# Altium schematic sheet Control_Sense_BOTTMOS V2.SchDoc (part 1 of 3)
size A2 portrait; SheetNumber: 4; SheetTotal: 5
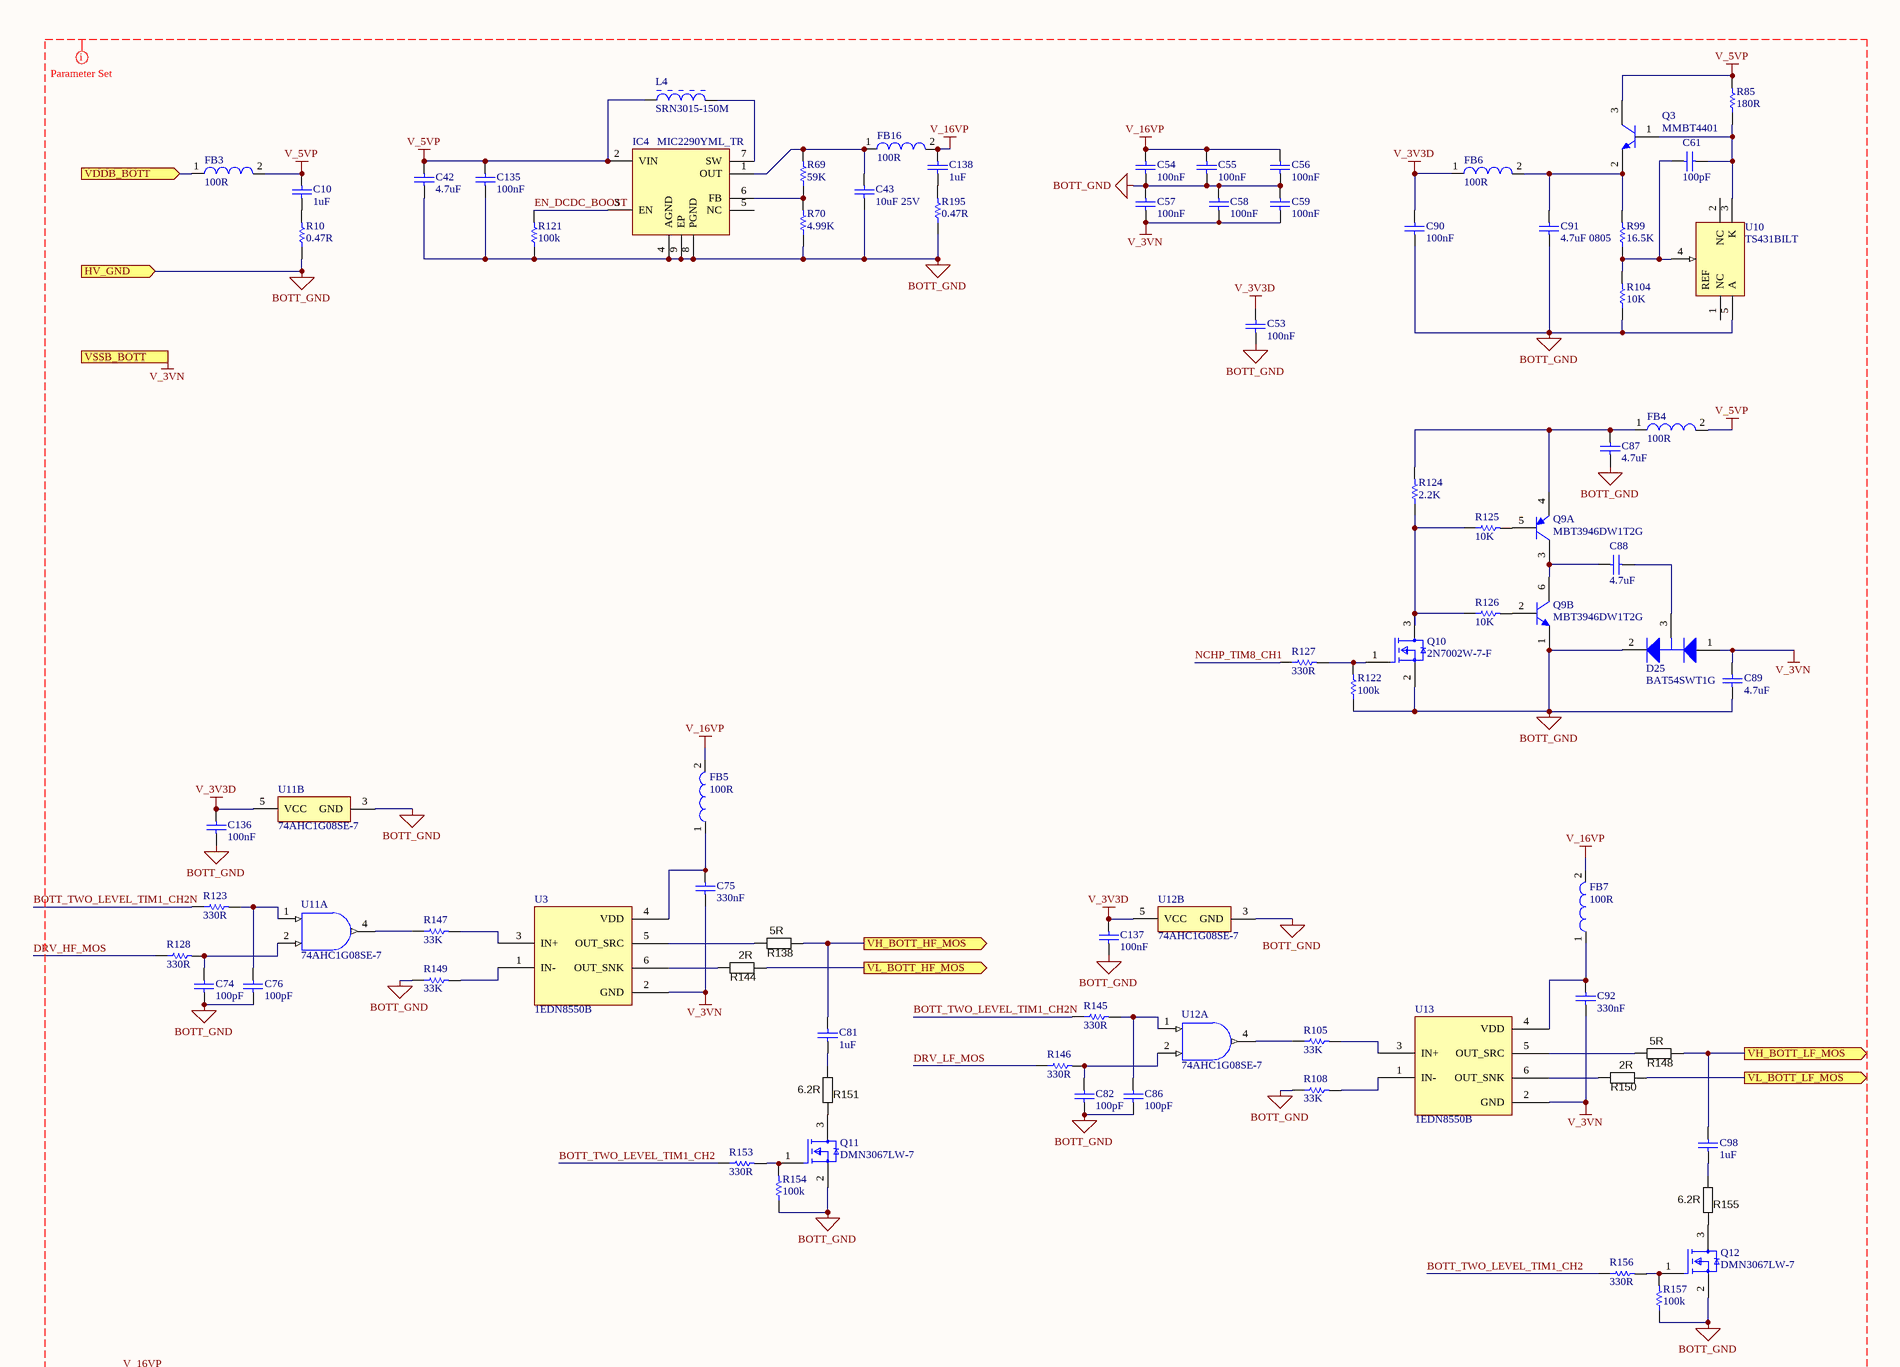
[diagram p0: Control_Sense_BOTTMOS V2.SchDoc, top]
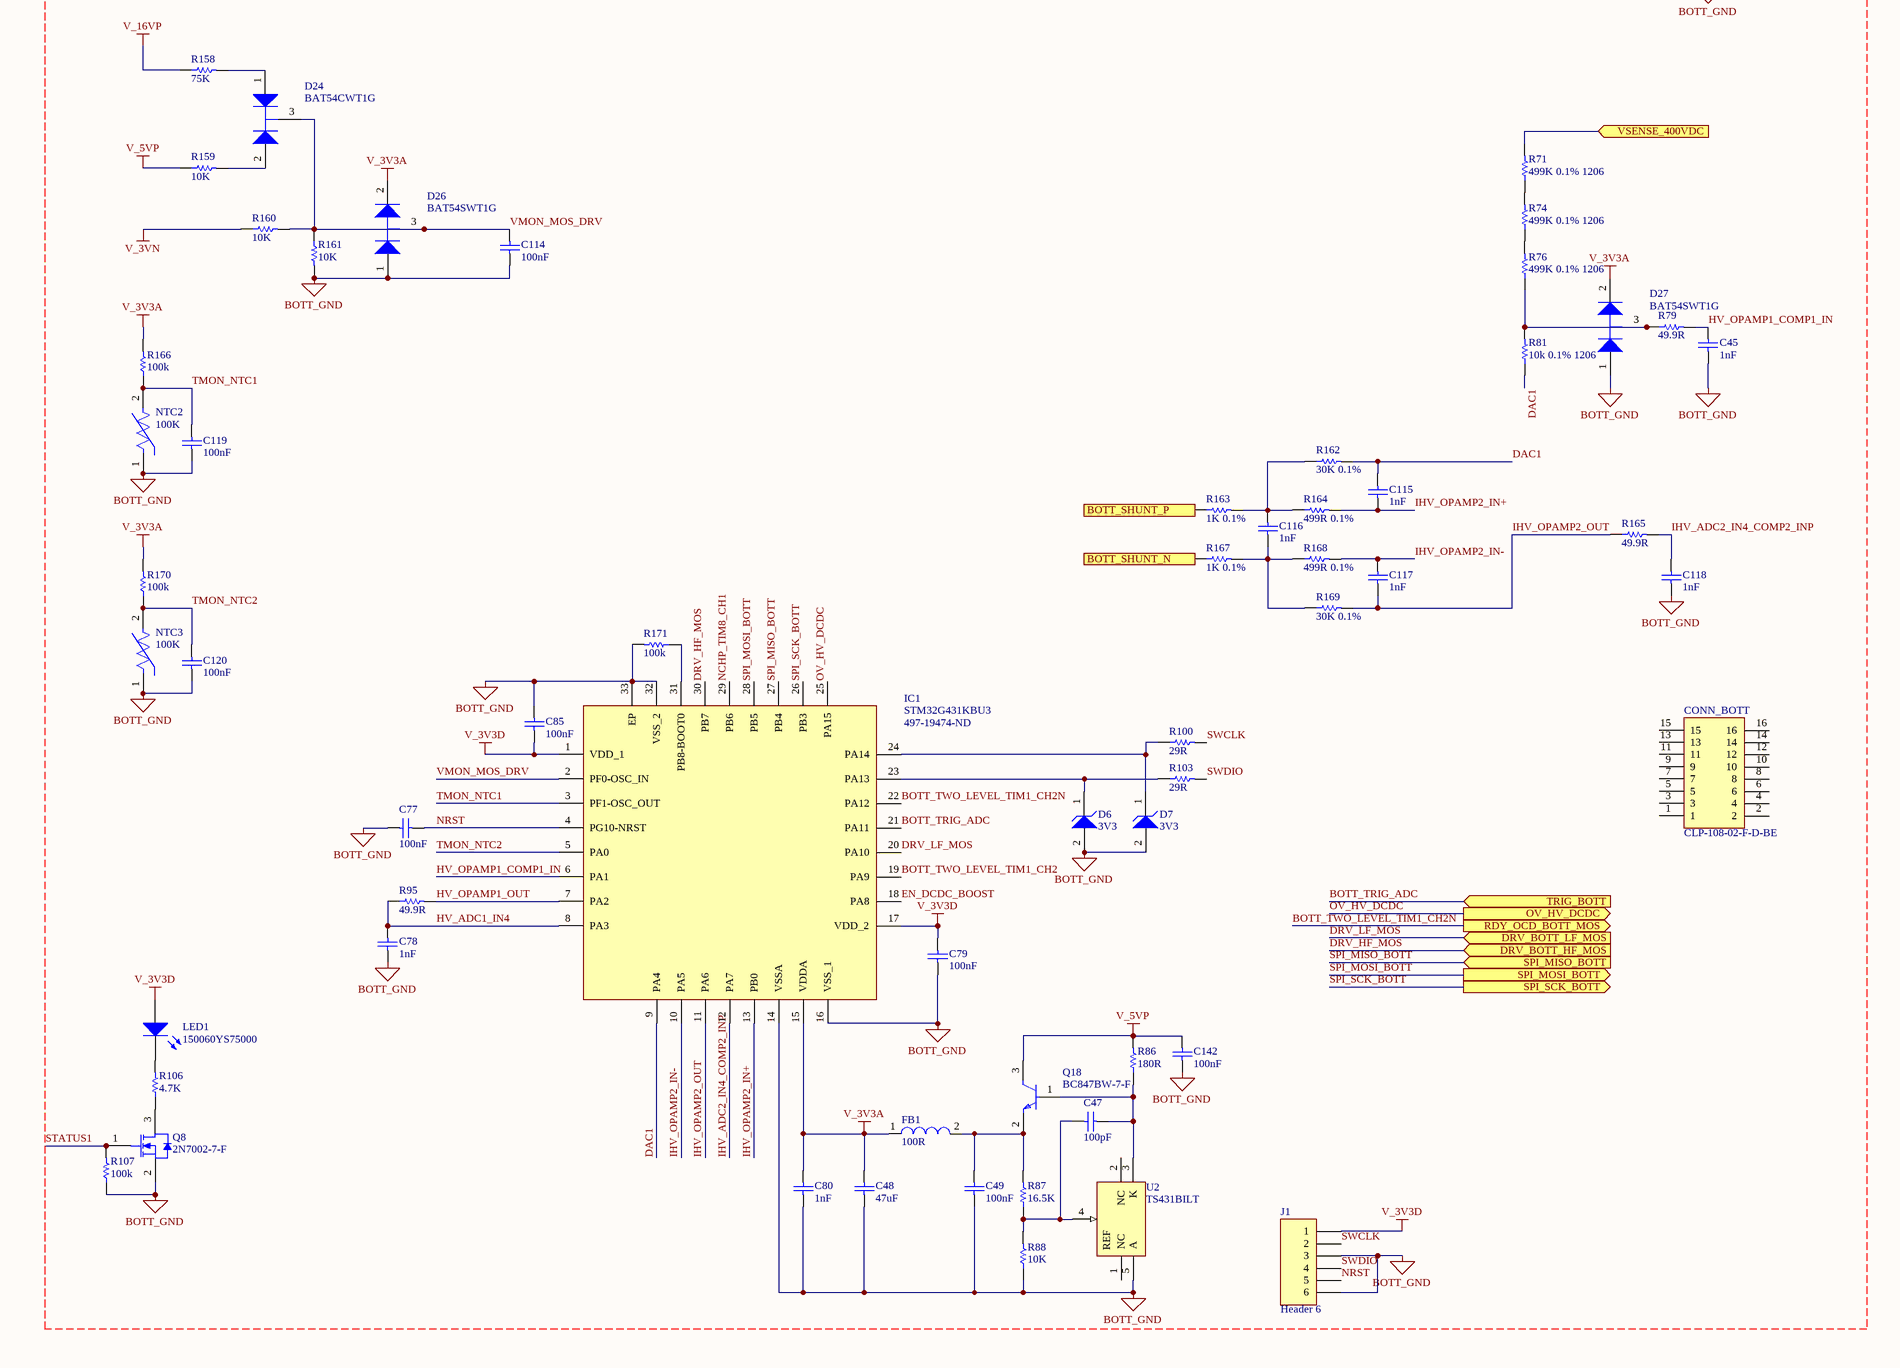
[diagram p1: Control_Sense_BOTTMOS V2.SchDoc, bottom]

## Parts
C10  1uF  [CAPC2013X140X50LL20T25]
C42  4.7uF  [CAPC2013X145X20NL20]
C43  10uF 25V  [CAPC3216X229X50LL20T25]
C45  1nF  [CAPC1005X56X25LL10T15]
C47  100pF  [CAPC1608X90X35NL10T15]
C48  47uF  [CAPC2013X145X50LL20T25]
C49  100nF  [SAMS-C0603-2_N]
C53  100nF  [CAPC1608X90X35LL15T15]
C54  100nF  [CAPC1608X90X35NL15T15]
C55  100nF  [CAPC1608X90X35NL15T15]
C56  100nF  [CAPC1608X90X35NL15T15]
C57  100nF  [CAPC1608X90X35NL15T15]
C58  100nF  [CAPC1608X90X35NL15T15]
C59  100nF  [CAPC1608X90X35NL15T15]
C61  100pF  [CAPC1608X90X35NL10T15]
C74  100pF  [CAPC1608X90X35NL10T15]
C75  330nF  [CAPC2013X135X45NL10T25]
C76  100pF  [CAPC1608X90X35NL10T15]
C77  100nF  [CAPC1608X90X35LL15T15]
C78  1nF  [CAPC1005X56X25LL10T15]
C79  100nF  [SAMS-C0603-2_N]
C80  1nF  [CAPC1005X56X25LL10T15]
C81  1uF  [CAPC2013X135X45NL10T25]
C82  100pF  [CAPC1608X90X35NL10T15]
C85  100nF  [CAPC1608X90X35LL15T15]
C86  100pF  [CAPC1608X90X35NL10T15]
C87  4.7uF  [SAMS-C0603-2_L]
C88  4.7uF  [SAMS-C0603-2_L]
C89  4.7uF  [SAMS-C0603-2_L]
C90  100nF  [SAMS-C0603-2_N]
C91  4.7uF 0805  [CAPC2013X145X20NL20]
C92  330nF  [CAPC2013X135X45NL10T25]
C98  1uF  [CAPC2013X135X45NL10T25]
C114  100nF  [CAPC1608X90X35LL15T15]
C115  1nF  [CAPC1005X56X25LL10T15]
C116  1nF  [CAPC1608X90X35LL15T15]
C117  1nF  [CAPC1005X56X25LL10T15]
C118  1nF  [CAPC1005X56X25LL10T15]
C119  100nF  [CAPC1608X90X35LL15T15]
C120  100nF  [CAPC1608X90X35LL15T15]
C135  100nF  [CAPC1608X90X35LL15T15]
C136  100nF  [CAPC1608X90X35LL15T15]
C137  100nF  [CAPC1608X90X35LL15T15]
C138  1uF  [CAPC2013X140X50LL20T25]
C142  100nF  [SAMS-C0603-2_N]
CONN_BOTT  CLP-108-02-F-D-BE  [CLP-108-02-XXX-D-BE]
D6  3V3  [ONSC-SOD-523-2-502-01_V]
D7  3V3  [ONSC-SOD-523-2-502-01_V]
D24  BAT54CWT1G  [ONSC-SOT-323-3-419-04_V]
D25  BAT54SWT1G  [ONSC-SOT-323-3-419-04_V]
D26  BAT54SWT1G  [ONSC-SOT-323-3-419-04_V]
D27  BAT54SWT1G  [ONSC-SOT-323-3-419-04_V]
FB1  100R  [SMD-0603]
FB3  100R  [SMD-0603]
FB4  100R  [SMD-0603]
FB5  100R  [SMD-0603]
FB6  100R  [SMD-0603]
FB7  100R  [SMD-0603]
FB16  100R  [SMD-0603]
IC1  STM32G431KBU3  Supplier Part Number 1: 497-19474-ND  [QFN50P500X500X60-33N-D]
IC4  MIC2290YML_TR  [SON50P200X200X95-9N-D]
J1  Header 6  [HDR1X6]
L4  SRN3015-150M  [BOUR-SRN3015-2_V]
LED1  150060YS75000  [0603_A]
NTC2  100K  [FP-NXR_151B030-MFG]
NTC3  100K  [FP-NXR_151B030-MFG]
Q3  MMBT4401  [FAIR-SOT23-3_V]
Q8  2N7002-7-F  [DIOD-SOT23-3_V]
Q9  MBT3946DW1T2G  [ONSC-SC70-6-419B-02_W_V]  (parts A,B of 2)
Q10  2N7002W-7-F  [FP-SOT323-IPC_C]
Q11  DMN3067LW-7  [FP-SOT323-IPC_C]
Q12  DMN3067LW-7  [FP-SOT323-IPC_C]
Q18  BC847BW-7-F  [FP-SOT323-IPC_C]
R10  0.47R  [RESC1608X55X25ML10T15]
R69  59K  [RESC1608X55X30NL15T15]
R70  4.99K  [RESC1609X50X30NL10T20]
R71  499K 0.1% 1206  [RESC3216X50X50NL20T25]
R74  499K 0.1% 1206  [RESC3216X50X50NL20T25]
R76  499K 0.1% 1206  [RESC3216X50X50NL20T25]
R79  49.9R  [RESC1005X40X25NL05T05]
R81  10k 0.1% 1206  [RESC3216X50X50NL20T20]
R85  180R  [RESC1608X55X25LL10T15]
R86  180R  [RESC1608X55X25LL10T15]
R87  16.5K  [RESC1608X55X30NL15T15]
R88  10K  [RESC1609X55X30NL15T15]
R95  49.9R  [RESC1005X40X25NL05T05]
R99  16.5K  [RESC1608X55X30NL15T15]
R100  29R  [RESC1608X55X30NL20T10]
R103  29R  [RESC1608X55X30NL20T10]
R104  10K  [RESC1609X55X30LL15T15]
R105  33K  [RESC1005X40X25ML05T05]
R106  4.7K  [RESC1608X55X25ML10T15]
R107  100k  [RESC1608X55X25ML10T15]
R108  33K  [RESC1005X40X25ML05T05]
R121  100k  [RESC1608X55X30NL15T15]
R122  100k  [RESC1608X55X30NL15T15]
R123  330R  [RESC1608X55X25NL10T15]
R124  2.2K  [RESC1608X55X25NL10T15]
R125  10K  [RESC1608X55X30NL20T10]
R126  10K  [RESC1608X55X30NL20T10]
R127  330R  [RESC1608X55X25NL10T15]
R128  330R  [RESC1608X55X25NL10T15]
R138  5R  [RESC2012X70N]
R144  2R  [RESC2012X70N]
R145  330R  [RESC1608X55X25NL10T15]
R146  330R  [RESC1608X55X25NL10T15]
R147  33K  [RESC1005X40X25ML05T05]
R148  5R  [RESC2012X70N]
R149  33K  [RESC1005X40X25ML05T05]
R150  2R  [RESC2012X70N]
R151  6.2R  [RESC2012X70N]
R153  330R  [RESC1608X55X25NL10T15]
R154  100k  [RESC1608X55X30NL15T15]
R155  6.2R  [RESC2012X70N]
R156  330R  [RESC1608X55X25NL10T15]
R157  100k  [RESC1608X55X30NL15T15]
R158  75K  [RESC1608X55X30NL15T15]
R159  10K  [RESC1608X55X30NL20T10]
R160  10K  [RESC1608X55X30NL20T10]
R161  10K  [RESC1608X55X30NL20T10]
R162  30K 0.1%  [RESC1608X55N]
R163  1K 0.1%  [RESC1608X55X25NL10T15]
R164  499R 0.1%  [RESC1608X55N]
R165  49.9R  [RESC1005X40X25NL05T05]
R166  100k  [RESC1608X55X30NL15T15]
R167  1K 0.1%  [RESC1608X55X25NL10T15]
R168  499R 0.1%  [RESC1608X55N]
R169  30K 0.1%  [RESC1608X55N]
R170  100k  [RESC1608X55X30NL15T15]
R171  100k  [RESC1608X55X30NL15T15]
R195  0.47R  [RESC1608X55X25ML10T15]
U2  TS431BILT  [SOT23-5_N]
U3  1EDN8550B  [SOT23-6]
U10  TS431BILT  [SOT23-5_N]
U11  74AHC1G08SE-7  [DCK0005A_M]  (parts A,B of 2)
U12  74AHC1G08SE-7  [DCK0005A_M]  (parts A,B of 2)
U13  1EDN8550B  [SOT23-6]

## Ports
BOTT_SHUNT_N (in), BOTT_SHUNT_P (in), DRV_BOTT_HF_MOS (in), DRV_BOTT_LF_MOS (in), HV_GND (in), OV_HV_DCDC (out), RDY_OCD_BOTT_MOS (out), SPI_MISO_BOTT (in), SPI_MOSI_BOTT (out), SPI_SCK_BOTT (out), TRIG_BOTT (in), VDDB_BOTT (in), VH_BOTT_HF_MOS (out), VH_BOTT_LF_MOS (out), VL_BOTT_HF_MOS (out), VL_BOTT_LF_MOS (out), VSENSE_400VDC (in), VSSB_BOTT (in)

## Nets
BOTT_GND: C42.1 C43.1 C45.1 C48.1 C49.1 C53.1 C54.1 C55.1 C56.1 C57.2 C58.2 C59.2 C74.1 C76.1 C77.1 C78.1 C79.1 C80.1 C82.1 C85.2 C86.1 C87.1 C89.1 C90.1 C91.1 C114.1 C118.1 C119.1 C120.1 C135.1 C136.1 C137.1 C142.1 D6.2(A) D7.2(A) D25.2(K) D26.1(A) D27.1(A) IC1.14(VSSA) IC1.16(VSS_1) IC1.32(VSS_2) IC1.33(EP) IC4.4(AGND) IC4.8(PGND) IC4.9(EP) J1.3 J1.6 NTC2.1 NTC3.1 Q8.2(S) Q9.1(E) Q10.2(S) Q11.2(S) Q12.2(S) R10.1 R70.1 R88.1 R104.1 R107.1 R108.1 R121.1 R122.1 R149.1 R154.1 R157.1 R161.2 R171.2 R195.1 U2.5(A) U10.5(A) U11.3(GND) U12.3(GND) ; port HV_GND
V_3V3A: C48.2 C80.2 D26.2(K) D27.2(K) FB1.1 IC1.15(VDDA) R166.2 R170.2
V_3V3D: C53.2 C79.2 C85.1 C90.2 C136.2 C137.2 FB6.1 IC1.1(VDD_1) IC1.17(VDD_2) J1.1 LED1.2(A) U11.5(VCC) U12.5(VCC)
V_3VN: C57.1 C58.1 C59.1 C75.1 C89.2 C92.1 D25.1(A) R160.1 U3.2(GND) U13.2(GND) ; port VSSB_BOTT
V_5VP: C10.2 C42.2 C135.2 C142.2 FB3.2 FB4.2 IC4.2(VIN) L4.1 Q3.3(C) Q18.3(C) R85.2 R86.2 R159.1
V_16VP: C54.2 C55.2 C56.2 C138.2 FB5.2 FB7.2 FB16.2 R158.1
BOTT_SHUNT_N: R167.1 ; port BOTT_SHUNT_N
BOTT_SHUNT_P: R163.1 ; port BOTT_SHUNT_P
BOTT_TRIG_ADC: IC1.21(PA11) ; port TRIG_BOTT
BOTT_TWO_LEVEL_TIM1_CH2: IC1.19(PA9) R153.1 R156.1
BOTT_TWO_LEVEL_TIM1_CH2N: IC1.22(PA12) R123.1 R145.1 ; port RDY_OCD_BOTT_MOS
DAC1: C115.2 IC1.9(PA4) R81.1 R162.2
DRV_HF_MOS: IC1.30(PB7) R128.1 ; port DRV_BOTT_HF_MOS
DRV_LF_MOS: IC1.20(PA10) R146.1 ; port DRV_BOTT_LF_MOS
EN_DCDC_BOOST: IC1.18(PA8) IC4.3(EN) R121.2
HV_ADC1_IN4: C78.2 IC1.8(PA3) R95.1
HV_OPAMP1_COMP1_IN: C45.2 IC1.6(PA1) R79.2
HV_OPAMP1_OUT: IC1.7(PA2) R95.2
IHV_ADC2_IN4_COMP2_INP: C118.2 IC1.12(PA7) R165.2
IHV_OPAMP2_IN+: C115.1 IC1.13(PB0) R164.2
IHV_OPAMP2_IN-: C117.2 IC1.10(PA5) R168.2
IHV_OPAMP2_OUT: C117.1 IC1.11(PA6) R165.1 R169.2
NCHP_TIM8_CH1: IC1.29(PB6) R127.1
NRST: C77.2 IC1.4(PG10-NRST) J1.5
OV_HV_DCDC: IC1.25(PA15) ; port OV_HV_DCDC
SPI_MISO_BOTT: IC1.27(PB4) ; port SPI_MISO_BOTT
SPI_MOSI_BOTT: IC1.28(PB5) ; port SPI_MOSI_BOTT
SPI_SCK_BOTT: IC1.26(PB3) ; port SPI_SCK_BOTT
STATUS1: Q8.1(G) R107.2
SWCLK: J1.2 R100.2
SWDIO: J1.4 R103.2
TMON_NTC1: C119.2 IC1.3(PF1-OSC_OUT) NTC2.2 R166.1
TMON_NTC2: C120.2 IC1.5(PA0) NTC3.2 R170.1
VDDB_BOTT: FB3.1 ; port VDDB_BOTT
VH_BOTT_HF_MOS: C81.2 R138.2 ; port VH_BOTT_HF_MOS
VH_BOTT_LF_MOS: C98.2 R148.2 ; port VH_BOTT_LF_MOS
VL_BOTT_HF_MOS: R144.2 ; port VL_BOTT_HF_MOS
VL_BOTT_LF_MOS: R150.2 ; port VL_BOTT_LF_MOS
VMON_MOS_DRV: C114.2 D24.3(K) D26.3(K/A) IC1.2(PF0-OSC_IN) R160.2 R161.1
VSENSE_400VDC: R71.2 ; port VSENSE_400VDC
NetC10_1: C10.1 R10.2
NetC43_2: C43.2 FB16.1 IC4.1(OUT) R69.2
NetC47_1: C47.1 R87.1 R88.2 U2.4(REF)
NetC47_2: C47.2 Q18.1(B) R86.1 U2.3(K)
NetC49_2: C49.2 FB1.2 Q18.2(E) R87.2
NetC61_1: C61.1 R99.1 R104.2 U10.4(REF)
NetC61_2: C61.2 Q3.1(B) R85.1 U10.3(K)
NetC74_2: C74.2 R128.2 U11.2(B)
NetC75_2: C75.2 FB5.1 U3.4(VDD)
NetC76_2: C76.2 R123.2 U11.1(A)
NetC81_1: C81.1 R151.2
NetC82_2: C82.2 R146.2 U12.2(B)
NetC86_2: C86.2 R145.2 U12.1(A)
NetC87_2: C87.2 FB4.1 Q9.4(E) R124.2
NetC88_1: C88.1 D25.3(K/A)
NetC88_2: C88.2 Q9.3(C) Q9.6(C)
NetC91_2: C91.2 FB6.2 Q3.2(E) R99.2
NetC92_2: C92.2 FB7.1 U13.4(VDD)
NetC98_1: C98.1 R155.2
NetC116_1: C116.1 R167.2 R168.1 R169.1
NetC116_2: C116.2 R162.1 R163.2 R164.1
NetC138_1: C138.1 R195.2
NetD6_1: D6.1(K) IC1.23(PA13) R103.1
NetD7_1: D7.1(K) IC1.24(PA14) R100.1
NetD24_1: D24.1(A1) R158.2
NetD24_2: D24.2(A2) R159.2
NetD27_3: D27.3(K/A) R76.1 R79.1 R81.2
NetIC1_31: IC1.31(PB8-BOOT0) R171.1
NetIC4_6: IC4.6(FB) R69.1 R70.2
NetIC4_7: IC4.7(SW) L4.2
NetLED1_1: LED1.1(K) R106.2
NetQ8_3: Q8.3(D) R106.1
NetQ9_2: Q9.2(B) R126.2
NetQ9_5: Q9.5(B) R125.2
NetQ10_1: Q10.1(G) R122.2 R127.2
NetQ10_3: Q10.3(D) R124.1 R125.1 R126.1
NetQ11_1: Q11.1(G) R153.2 R154.2
NetQ11_3: Q11.3(D) R151.1
NetQ12_1: Q12.1(G) R156.2 R157.2
NetQ12_3: Q12.3(D) R155.1
NetR71_1: R71.1 R74.2
NetR74_1: R74.1 R76.2
NetR105_1: R105.1 U12.4(Y)
NetR105_2: R105.2 U13.3(IN+)
NetR108_2: R108.2 U13.1(IN-)
NetR138_1: R138.1 U3.5(OUT_SRC)
NetR144_1: R144.1 U3.6(OUT_SNK)
NetR147_1: R147.1 U11.4(Y)
NetR147_2: R147.2 U3.3(IN+)
NetR148_1: R148.1 U13.5(OUT_SRC)
NetR149_2: R149.2 U3.1(IN-)
NetR150_1: R150.1 U13.6(OUT_SNK)

Not connected (* = marked no-connect by the designer): CONN_BOTT 1 2 3 4 5 6 7 8 9 10 11 12 13 14 15 16; IC4 5(NC); U2 1(NC) 2(NC); U10 1(NC) 2(NC)

## Layout directives
net class BOTT: BOTT_GND, BOTT_TRIG_ADC, BOTT_TWO_LEVEL_TIM1_CH2, BOTT_TWO_LEVEL_TIM1_CH2N, DAC1, DRV_HF_MOS, DRV_LF_MOS, EN_DCDC_BOOST, HV_ADC1_IN4, HV_OPAMP1_COMP1_IN, HV_OPAMP1_OUT, IHV_ADC2_IN4_COMP2_INP, IHV_OPAMP2_IN+, IHV_OPAMP2_IN-, IHV_OPAMP2_OUT, NCHP_TIM8_CH1, NRST, OV_HV_DCDC, SPI_MISO_BOTT, SPI_MOSI_BOTT, SPI_SCK_BOTT, STATUS1, SWCLK, SWDIO, TMON_NTC1, TMON_NTC2, V_3V3A, V_3V3D, V_3VN, V_5VP, V_16VP, VMON_MOS_DRV